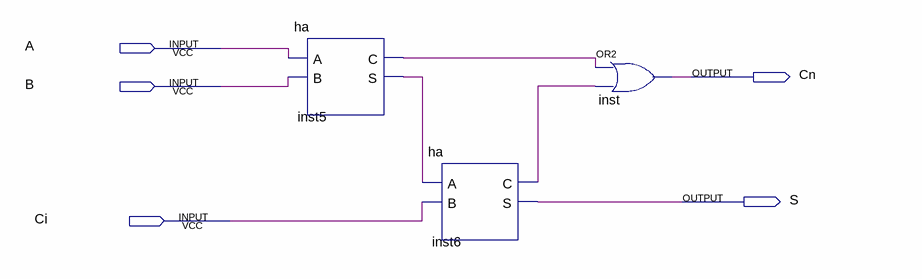
[diagram p0: schematic sheet]
// Quartus schematic fa.bdf as structural Verilog: 3 symbols, 5 pins
module fa (
  input  A,
  input  B,
  input  Ci,
  output Cn,
  output S
);

  wire inst5_c, inst5_s, inst6_c;

  ha inst5 (.A(A), .B(B), .C(inst5_c), .S(inst5_s));
  ha inst6 (.A(inst5_s), .B(Ci), .C(inst6_c), .S(S));
  or inst (Cn, inst5_c, inst6_c);
endmodule
